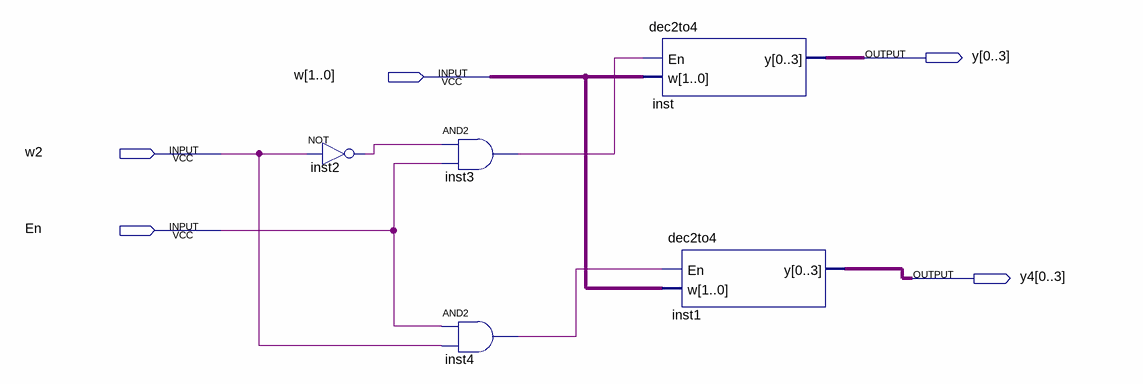
[diagram p0: schematic sheet]
// Quartus schematic modifiedDec.bdf as structural Verilog: 5 symbols, 5 pins
module modifiedDec (
  input  [1:0] w,
  input  w2,
  input  En,
  output [0:3] y,
  output [0:3] y4
);

  wire inst2_out, inst3_out, inst4_out;

  not inst2 (inst2_out, w2);
  and inst3 (inst3_out, inst2_out, En);
  and inst4 (inst4_out, En, w2);
  dec2to4 inst (.En(inst3_out), .w(w), .y(y));
  dec2to4 inst1 (.En(inst4_out), .w(w), .y(y4));
endmodule
